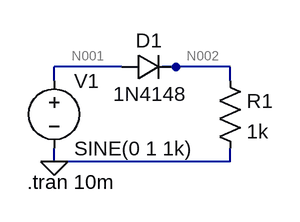
[diagram p0: schematic Draft3.asc]
Draft3.asc, the LTspice schematic file:
Version 4
SHEET 1 880 680
WIRE 80 144 0 144
WIRE 144 144 128 144
WIRE 208 144 144 144
WIRE 0 160 0 144
WIRE 208 160 208 144
WIRE 0 256 0 240
WIRE 208 256 208 240
WIRE 208 256 0 256
FLAG 0 256 0
SYMBOL voltage 0 144 R0
WINDOW 123 0 0 Left 0
WINDOW 39 0 0 Left 0
SYMATTR InstName V1
SYMATTR Value SINE(0 1 1k)
SYMBOL res 192 144 R0
SYMATTR InstName R1
SYMATTR Value 1k
SYMBOL diode 80 160 R270
WINDOW 0 32 32 VTop 2
WINDOW 3 0 32 VBottom 2
SYMATTR InstName D1
SYMATTR Value 1N4148
TEXT -32 280 Left 2 !.tran 10m

The netlist it stands for:
* Draft3.asc
V1 N001 0 SINE(0 1 1k)
R1 N002 0 1k
D1 N001 N002 1N4148
.model D D
.lib standard.dio
.tran 10m
.backanno
.end

* Results of the author's LTspice run, read from the files saved beside the schematic
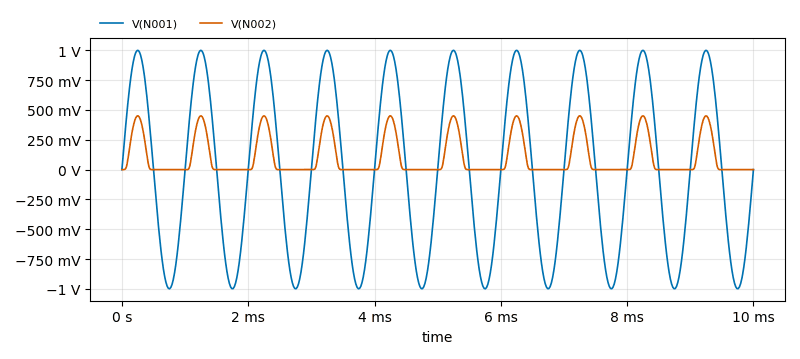
[diagram p1: Transient Analysis of Draft3.asc, plotted from the saved traces]
* Transient Analysis, 1 run:
*   V(N001): min -999.5 mV, max 1 V, average 273.7 µV, rms 707.1 mV, last 0 V
*   V(N002): min -26.03 µV, max 450.7 mV, average 102.1 mV, rms 189.1 mV, last 24.16 µV